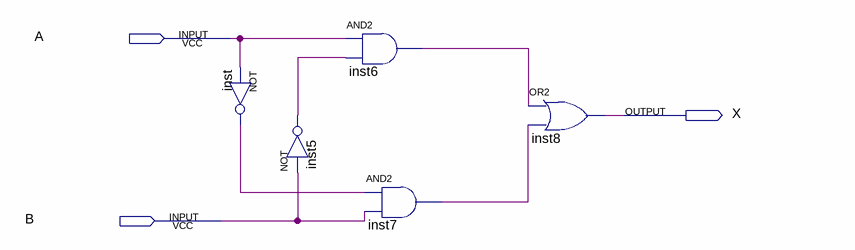
[diagram p0: schematic sheet]
// Quartus schematic ProjetoGrupo9.bdf as structural Verilog: 5 symbols, 3 pins
module ProjetoGrupo9 (
  input  A,
  input  B,
  output X
);

  wire inst5_out, inst6_out, inst7_out, inst_out;

  not inst (inst_out, A);
  not inst5 (inst5_out, B);
  and inst6 (inst6_out, A, inst5_out);
  and inst7 (inst7_out, inst_out, B);
  or inst8 (X, inst6_out, inst7_out);
endmodule
